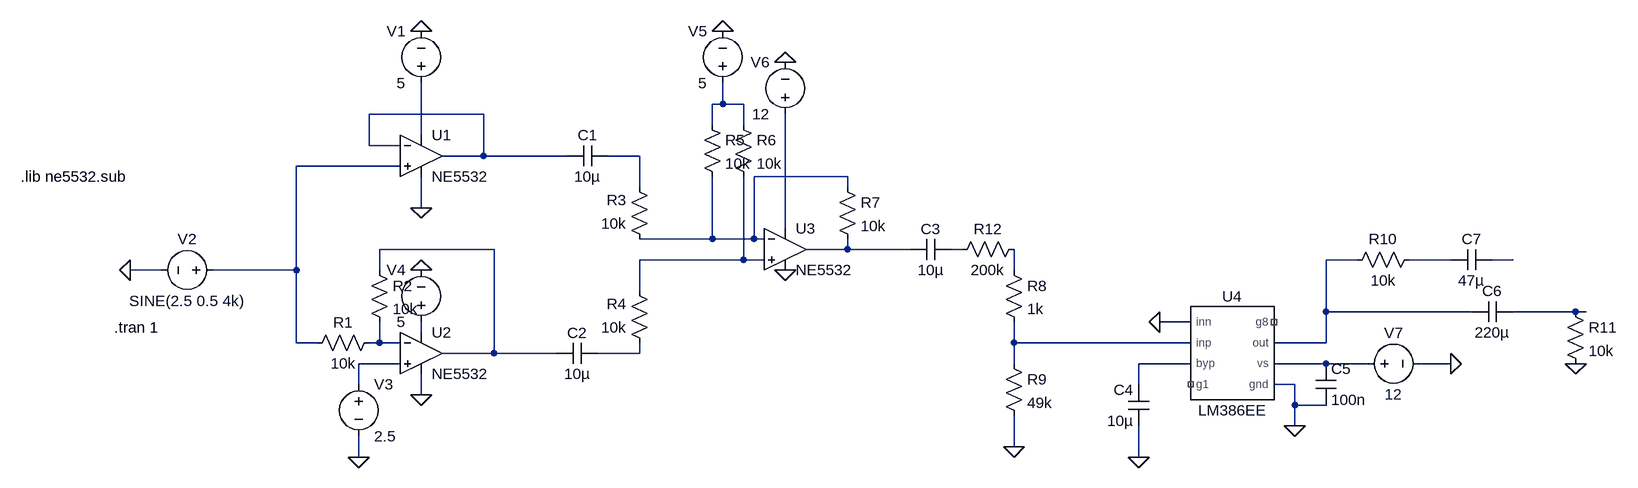
[diagram p0: schematic audio_diff_and_comb.asc]
audio_diff_and_comb.asc, the LTspice schematic file:
Version 4.1
SHEET 1 2004 692
WIRE 624 128 624 96
WIRE 624 128 608 128
WIRE 656 128 624 128
WIRE 256 144 80 144
WIRE 608 160 608 128
WIRE 656 160 656 128
WIRE 160 176 160 96
WIRE 80 192 80 144
WIRE 128 192 80 192
WIRE 256 208 256 144
WIRE 256 208 192 208
WIRE 384 208 256 208
WIRE 496 208 448 208
WIRE 128 224 -32 224
WIRE 816 240 672 240
WIRE 496 256 496 208
WIRE 816 256 816 240
WIRE 160 288 160 240
WIRE 720 320 720 144
WIRE 608 336 608 240
WIRE 608 336 496 336
WIRE 672 336 672 240
WIRE 672 336 608 336
WIRE 688 336 672 336
WIRE 272 352 96 352
WIRE 816 352 816 336
WIRE 816 352 752 352
WIRE 912 352 816 352
WIRE 992 352 976 352
WIRE 656 368 656 240
WIRE 656 368 496 368
WIRE 688 368 656 368
WIRE 1600 368 1552 368
WIRE 1744 368 1680 368
WIRE 1840 368 1808 368
WIRE -240 384 -288 384
WIRE -32 384 -32 224
WIRE -32 384 -160 384
WIRE 96 384 96 352
WIRE 1072 384 1072 352
WIRE 496 416 496 368
WIRE 1552 448 1552 368
WIRE 1776 448 1552 448
WIRE 1936 448 1840 448
WIRE 1952 448 1936 448
WIRE 1344 464 1296 464
WIRE 160 480 160 464
WIRE -32 496 -32 384
WIRE 0 496 -32 496
WIRE 96 496 96 464
WIRE 96 496 80 496
WIRE 128 496 96 496
WIRE 1072 496 1072 464
WIRE 1344 496 1072 496
WIRE 1552 496 1552 448
WIRE 1552 496 1472 496
WIRE 272 512 272 352
WIRE 272 512 192 512
WIRE 368 512 272 512
WIRE 496 512 496 496
WIRE 496 512 432 512
WIRE 128 528 64 528
WIRE 1072 528 1072 496
WIRE 1344 528 1264 528
WIRE 1552 528 1472 528
WIRE 1616 528 1552 528
WIRE 1744 528 1696 528
WIRE 64 560 64 528
WIRE 1264 560 1264 528
WIRE 1504 560 1472 560
WIRE 160 576 160 544
WIRE 1504 592 1504 560
WIRE 1552 592 1504 592
WIRE 1504 624 1504 592
WIRE 1072 656 1072 608
WIRE 64 672 64 640
WIRE 1264 672 1264 624
FLAG 160 288 0
FLAG -288 384 0
FLAG 160 16 0
FLAG 160 384 0
FLAG 160 576 0
FLAG 64 672 0
FLAG 624 16 0
FLAG 720 64 0
FLAG 720 384 0
FLAG 1072 656 0
FLAG 1296 464 0
FLAG 1264 672 0
FLAG 1504 624 0
FLAG 1744 528 0
FLAG 1936 528 0
SYMBOL OpAmps\\opamp2 160 144 R0
SYMATTR InstName U1
SYMATTR Value NE5532
SYMBOL voltage -144 384 R90
WINDOW 0 -32 56 VBottom 2
WINDOW 3 32 56 VTop 2
WINDOW 123 0 0 Left 0
WINDOW 39 0 0 Left 0
SYMATTR InstName V2
SYMATTR Value SINE(2.5 0.5 4k)
SYMBOL voltage 160 112 R180
WINDOW 0 24 96 Left 2
WINDOW 3 24 16 Left 2
WINDOW 123 0 0 Left 0
WINDOW 39 0 0 Left 0
SYMATTR InstName V1
SYMATTR Value 5
SYMBOL OpAmps\\opamp2 160 448 R0
SYMATTR InstName U2
SYMATTR Value NE5532
SYMBOL res 96 480 R90
WINDOW 0 0 56 VBottom 2
WINDOW 3 32 56 VTop 2
SYMATTR InstName R1
SYMATTR Value 10k
SYMBOL voltage 64 544 R0
WINDOW 123 0 0 Left 0
WINDOW 39 0 0 Left 0
SYMATTR InstName V3
SYMATTR Value 2.5
SYMBOL voltage 160 480 R180
WINDOW 0 24 96 Left 2
WINDOW 3 24 16 Left 2
WINDOW 123 0 0 Left 0
WINDOW 39 0 0 Left 0
SYMATTR InstName V4
SYMATTR Value 5
SYMBOL res 80 368 R0
SYMATTR InstName R2
SYMATTR Value 10k
SYMBOL cap 448 192 R90
WINDOW 0 0 32 VBottom 2
WINDOW 3 32 32 VTop 2
SYMATTR InstName C1
SYMATTR Value 10µ
SYMBOL cap 432 496 R90
WINDOW 0 0 32 VBottom 2
WINDOW 3 32 32 VTop 2
SYMATTR InstName C2
SYMATTR Value 10µ
SYMBOL OpAmps\\opamp2 720 288 R0
SYMATTR InstName U3
SYMATTR Value NE5532
SYMBOL res 512 352 R180
WINDOW 0 36 76 Left 2
WINDOW 3 36 40 Left 2
SYMATTR InstName R3
SYMATTR Value 10k
SYMBOL res 512 512 R180
WINDOW 0 36 76 Left 2
WINDOW 3 36 40 Left 2
SYMATTR InstName R4
SYMATTR Value 10k
SYMBOL voltage 624 112 R180
WINDOW 0 24 96 Left 2
WINDOW 3 24 16 Left 2
WINDOW 123 0 0 Left 0
WINDOW 39 0 0 Left 0
SYMATTR InstName V5
SYMATTR Value 5
SYMBOL res 592 144 R0
SYMATTR InstName R5
SYMATTR Value 10k
SYMBOL res 640 144 R0
SYMATTR InstName R6
SYMATTR Value 10k
SYMBOL voltage 720 160 R180
WINDOW 0 24 96 Left 2
WINDOW 3 24 16 Left 2
WINDOW 123 0 0 Left 0
WINDOW 39 0 0 Left 0
SYMATTR InstName V6
SYMATTR Value 12
SYMBOL res 800 240 R0
SYMATTR InstName R7
SYMATTR Value 10k
SYMBOL cap 976 336 R90
WINDOW 0 0 32 VBottom 2
WINDOW 3 32 32 VTop 2
SYMATTR InstName C3
SYMATTR Value 10µ
SYMBOL res 1056 368 R0
SYMATTR InstName R8
SYMATTR Value 1k
SYMBOL res 1056 512 R0
SYMATTR InstName R9
SYMATTR Value 49k
SYMBOL LM386EE 1408 512 R0
SYMATTR InstName U4
SYMBOL cap 1280 624 R180
WINDOW 0 24 56 Left 2
WINDOW 3 24 8 Left 2
SYMATTR InstName C4
SYMATTR Value 10µ
SYMBOL voltage 1600 528 R270
WINDOW 0 32 56 VTop 2
WINDOW 3 -32 56 VBottom 2
WINDOW 123 0 0 Left 0
WINDOW 39 0 0 Left 0
SYMATTR InstName V7
SYMATTR Value 12
SYMBOL cap 1536 528 R0
SYMATTR InstName C5
SYMATTR Value 100n
SYMBOL cap 1840 432 R90
WINDOW 0 0 32 VBottom 2
WINDOW 3 32 32 VTop 2
SYMATTR InstName C6
SYMATTR Value 220µ
SYMBOL res 1696 352 R90
WINDOW 0 0 56 VBottom 2
WINDOW 3 32 56 VTop 2
SYMATTR InstName R10
SYMATTR Value 10k
SYMBOL cap 1808 352 R90
WINDOW 0 0 32 VBottom 2
WINDOW 3 32 32 VTop 2
SYMATTR InstName C7
SYMATTR Value 47µ
SYMBOL res 1920 432 R0
SYMATTR InstName R11
SYMATTR Value 10k
SYMBOL res 1088 336 R90
WINDOW 0 0 56 VBottom 2
WINDOW 3 32 56 VTop 2
SYMATTR InstName R12
SYMATTR Value 200k
TEXT -312 472 Left 2 !.tran 1
TEXT -456 240 Left 2 !.lib ne5532.sub

The netlist it stands for:
* audio_diff_and_comb.asc
X§U1 N005 N002 N003 0 N002 NE5532  ; pins In+ In- V+ V- OUT
V2 N005 0 SINE(2.5 0.5 4k)
V1 N003 0 5
X§U2 N021 N018 N017 0 N008 NE5532  ; pins In+ In- V+ V- OUT
R1 N018 N005 10k
V3 N021 0 2.5
V4 N017 0 5
R2 N008 N018 10k
C1 N004 N002 10µ
C2 N020 N008 10µ
X§U3 N011 N006 N007 0 N009 NE5532  ; pins In+ In- V+ V- OUT
R3 N006 N004 10k
R4 N020 N011 10k
V5 N001 0 5
R5 N001 N006 10k
R6 N001 N011 10k
V6 N007 0 12
R7 N006 N009 10k
C3 N010 N009 10µ
R8 N015 N019 1k
R9 N019 0 49k
X§U4 0 N019 N022 NC_01 NC_02 N012 N023 0 LM386EE  ; pins inn inp byp g1 g8 out vs gnd
C4 0 N022 10µ
V7 N023 0 12
C5 N023 0 100n
C6 N016 N012 220µ
R10 N013 N012 10k
C7 N014 N013 47µ
R11 N016 0 10k
R12 N015 N010 200k
.tran 1
.lib ne5532.sub
.lib C:\Users\USER\Documents\LTspice\LM386EE.sub
.backanno
.end